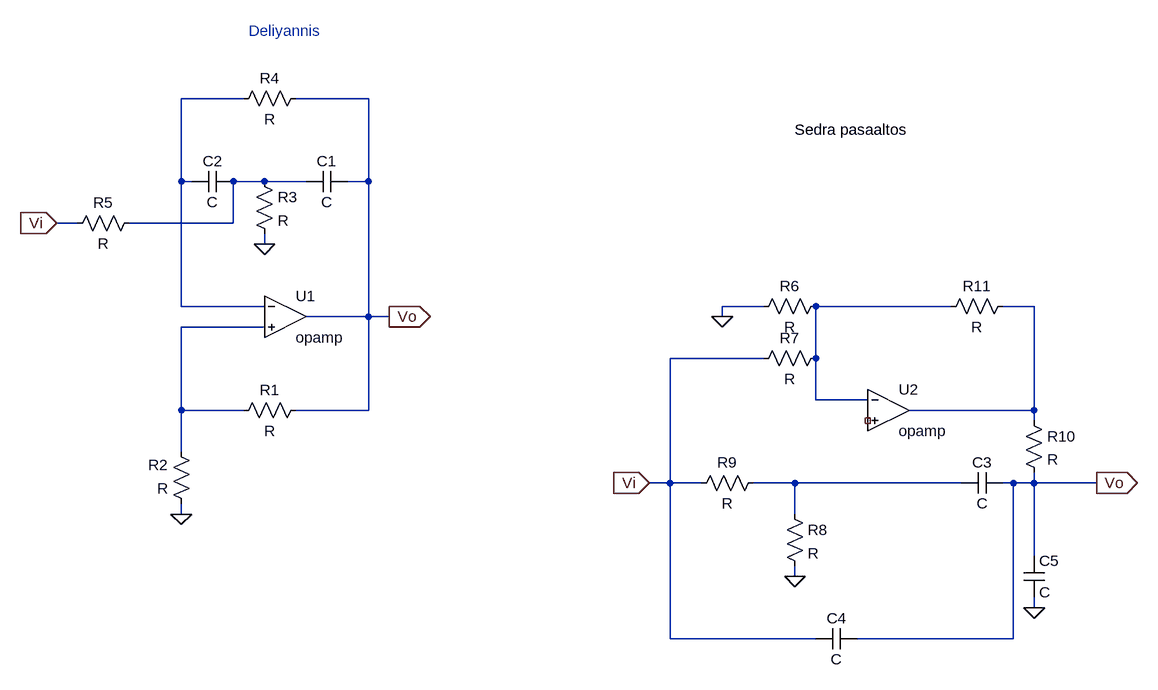
[diagram p0: schematic Draw.asc]
Draw.asc, the LTspice schematic file:
Version 4
SHEET 1 1548 704
WIRE 144 -176 48 -176
WIRE 336 -176 224 -176
WIRE 48 -48 48 -176
WIRE 64 -48 48 -48
WIRE 176 -48 128 -48
WIRE 240 -48 176 -48
WIRE 336 -48 336 -176
WIRE 336 -48 304 -48
WIRE -112 16 -144 16
WIRE 128 16 128 -48
WIRE 128 16 -32 16
WIRE 176 48 176 32
WIRE 48 144 48 -48
WIRE 176 144 48 144
WIRE 944 144 880 144
WIRE 1232 144 1024 144
WIRE 1360 144 1312 144
WIRE 336 160 336 -48
WIRE 336 160 240 160
WIRE 368 160 336 160
WIRE 880 160 880 144
WIRE 176 176 48 176
WIRE 944 224 800 224
WIRE 1024 224 1024 144
WIRE 1024 288 1024 224
WIRE 1104 288 1024 288
WIRE 48 304 48 176
WIRE 144 304 48 304
WIRE 336 304 336 160
WIRE 336 304 224 304
WIRE 1360 304 1360 144
WIRE 1360 304 1168 304
WIRE 1360 320 1360 304
WIRE 48 368 48 304
WIRE 800 416 800 224
WIRE 800 416 768 416
WIRE 848 416 800 416
WIRE 992 416 928 416
WIRE 1248 416 992 416
WIRE 1328 416 1312 416
WIRE 1360 416 1360 400
WIRE 1360 416 1328 416
WIRE 1456 416 1360 416
WIRE 48 464 48 448
WIRE 992 464 992 416
WIRE 1360 528 1360 416
WIRE 992 560 992 544
WIRE 1360 608 1360 592
WIRE 800 656 800 416
WIRE 1024 656 800 656
WIRE 1328 656 1328 416
WIRE 1328 656 1088 656
FLAG 48 464 0
FLAG 176 48 0
FLAG -144 16 Vi
IOPIN -144 16 In
FLAG 368 160 Vo
IOPIN 368 160 Out
FLAG 880 160 0
FLAG 992 560 0
FLAG 1360 608 0
FLAG 768 416 Vi
IOPIN 768 416 In
FLAG 1456 416 Vo
IOPIN 1456 416 Out
SYMBOL Opamps\\opamp 208 96 R0
SYMATTR InstName U1
SYMBOL res 240 288 R90
WINDOW 0 0 56 VBottom 2
WINDOW 3 32 56 VTop 2
SYMATTR InstName R1
SYMBOL res 64 464 R180
WINDOW 0 36 76 Left 2
WINDOW 3 36 40 Left 2
SYMATTR InstName R2
SYMBOL cap 304 -64 R90
WINDOW 0 0 32 VBottom 2
WINDOW 3 32 32 VTop 2
SYMATTR InstName C1
SYMBOL cap 128 -64 R90
WINDOW 0 0 32 VBottom 2
WINDOW 3 32 32 VTop 2
SYMATTR InstName C2
SYMBOL res 160 -64 R0
SYMATTR InstName R3
SYMBOL res 240 -192 R90
WINDOW 0 0 56 VBottom 2
WINDOW 3 32 56 VTop 2
SYMATTR InstName R4
SYMBOL res -16 0 R90
WINDOW 0 0 56 VBottom 2
WINDOW 3 32 56 VTop 2
SYMATTR InstName R5
SYMBOL Opamps\\opamp 1136 240 R0
SYMATTR InstName U2
SYMBOL res 1040 128 R90
WINDOW 0 0 56 VBottom 2
WINDOW 3 32 56 VTop 2
SYMATTR InstName R6
SYMBOL res 1040 208 R90
WINDOW 0 0 56 VBottom 2
WINDOW 3 32 56 VTop 2
SYMATTR InstName R7
SYMBOL res 976 448 R0
SYMATTR InstName R8
SYMBOL res 944 400 R90
WINDOW 0 0 56 VBottom 2
WINDOW 3 32 56 VTop 2
SYMATTR InstName R9
SYMBOL cap 1312 400 R90
WINDOW 0 0 32 VBottom 2
WINDOW 3 32 32 VTop 2
SYMATTR InstName C3
SYMBOL cap 1088 640 R90
WINDOW 0 0 32 VBottom 2
WINDOW 3 32 32 VTop 2
SYMATTR InstName C4
SYMBOL res 1344 304 R0
SYMATTR InstName R10
SYMBOL cap 1344 528 R0
SYMATTR InstName C5
SYMBOL res 1328 128 R90
WINDOW 0 0 56 VBottom 2
WINDOW 3 32 56 VTop 2
SYMATTR InstName R11
TEXT 152 -280 Left 2 ;Deliyannis
TEXT 992 -128 Left 2 !Sedra pasaaltos

The netlist it stands for:
* Draw.asc
XU1 N001 N005 Vo opamp Aol=100K GBW=10Meg  ; pins invin noninvin out
R1 Vo N005 R
R2 0 N005 R
C1 Vo N002 C
C2 N002 N001 C
R3 N002 0 R
R4 Vo N001 R
R5 N002 Vi R
XU2 N003 NC_01 N004 opamp Aol=100K GBW=10Meg  ; pins invin noninvin out
R6 N003 0 R
R7 N003 Vi R
R8 N006 0 R
R9 N006 Vi R
C3 Vo N006 C
C4 Vo Vi C
R10 N004 Vo R
C5 Vo 0 C
R11 N004 N003 R
* Deliyannis
Sedra pasaaltos
.backanno
.end